# Altium project DEP_REVC.PrjPcb
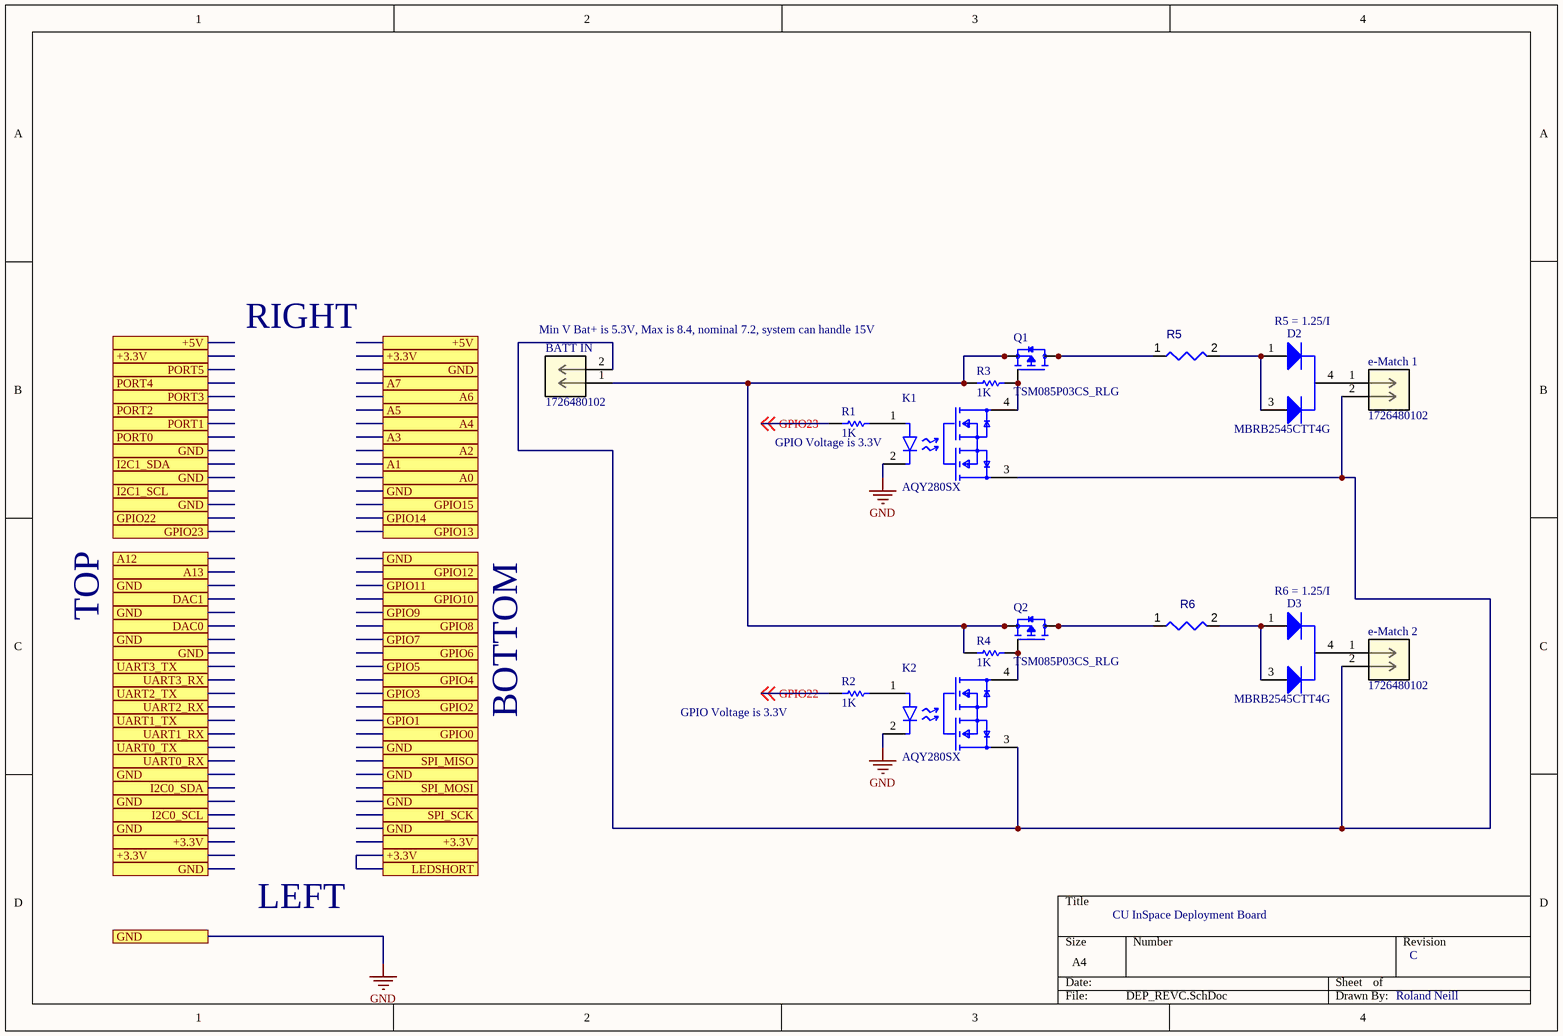
[diagram p0: DEP_REVC.SchDoc]
1 sheet, 15 parts. Net scope: flat (ports and power ports of the same name join across sheets).
Board file: DEP_REVC.PcbDoc

## Sheet DEP_REVC.SchDoc
size A4; SheetNumber: 1; SheetTotal: 1; SPICEModelCacheUQVOHRBJ: <root> / <DocumentId>UQVOHRBJ</DocumentId> / </root>

### Parts
BATT_IN  1726480102  [CON_1726480102]
D2  MBRB2545CTT4G  [ONSC-D2PAK-3-418B-04_V]
D3  MBRB2545CTT4G  [ONSC-D2PAK-3-418B-04_V]
e-Match_1  1726480102  [CON_1726480102]
e-Match_2  1726480102  [CON_1726480102]
K1  AQY280SX  [FP-AQY282SZ-IPC_A]
K2  AQY280SX  [FP-AQY282SZ-IPC_A]
Q1  TSM085P03CS_RLG  [SOP127P600X200-8N]
Q2  TSM085P03CS_RLG  [SOP127P600X200-8N]
R1  value 1K  [6-0805_N]  (hidden comment: Resistor)
R2  value 1K  [6-0805_N]  (hidden comment: Resistor)
R3  value 1K  [6-0805_N]  (hidden comment: Resistor)
R4  value 1K  [6-0805_N]  (hidden comment: Resistor)
R5  35221R5JT  [RESC6432X12N]  (value not drawn)
R6  35221R5JT  [RESC6432X12N]  (value not drawn)

### Ports
+3.3V (see DEP_REVC[1B], DEP_REVC[1D]), +5V (see DEP_REVC[1B]), A0, A1, A2, A3, A4, A5, A6, A7, A12, A13, DAC0, DAC1, GND (see DEP_REVC[1B], DEP_REVC[1C], DEP_REVC[1D]), GPIO0, GPIO1, GPIO2, GPIO3, GPIO4, GPIO5, GPIO6, GPIO7, GPIO8, GPIO9, GPIO10, GPIO11, GPIO12, GPIO13, GPIO14, GPIO15, GPIO22, GPIO23, I2C0_SCL, I2C0_SDA, I2C1_SCL, I2C1_SDA, LEDSHORT, PORT0, PORT1, PORT2, PORT3, PORT4, PORT5, SPI_MISO, SPI_MOSI, SPI_SCK, UART0_RX, UART0_TX, UART1_RX, UART1_TX, UART2_RX, UART2_TX, UART3_RX, UART3_TX

### Nets
GND: K1.2(DC-) K2.2(DC-) ; port GND
+3.3V: port +3.3V, port LEDSHORT
GPIO22: R2.1 ; off-sheet GPIO22
GPIO23: R1.1 ; off-sheet GPIO23
NetBATT_IN_1: BATT_IN.1 Q1.1(S) Q1.2(S) Q1.3(S) Q2.1(S) Q2.2(S) Q2.3(S) R3.1 R4.1
NetBATT_IN_2: BATT_IN.2 e-Match_1.2 e-Match_2.2 K1.3(1_AC/DC) K2.3(1_AC/DC)
NetD2_1: D2.1(A1) D2.3(A2) R5.2
NetD2_4: D2.4(K) e-Match_1.1
NetD3_1: D3.1(A1) D3.3(A2) R6.2
NetD3_4: D3.4(K) e-Match_2.1
NetK1_1: K1.1(DC+) R1.2
NetK1_4: K1.4(2_AC/DC) Q1.4(G) R3.2
NetK2_1: K2.1(DC+) R2.2
NetK2_4: K2.4(2_AC/DC) Q2.4(G) R4.2
NetQ1_5: Q1.5(D) Q1.6(D) Q1.7(D) Q1.8(D) R5.1
NetQ2_5: Q2.5(D) Q2.6(D) Q2.7(D) Q2.8(D) R6.1

### Notes on the sheet
- RIGHT
- (near BATT_IN) Min V Bat+ is 5.3V, Max is 8.4, nominal 7.2, system can handle 15V
- (near D2) R5 = 1.25/I
- GPIO Voltage is 3.3V
- TOP
- BOTTOM
- (near D3) R6 = 1.25/I
- (near R2) GPIO Voltage is 3.3V
- LEFT
- CU InSpace Deployment Board
- C
- Roland Neill

### Library data of the parts
BATT_IN e-Match_1 e-Match_2 = 1726480102: No Description Available; Mfr_Name: Molex Connector Corporation; Copyright: Copyright (C) 2022 Ultra Librarian. All rights reserved.; Manufacturer_Part_Number: 1726480102; RefDes: RefDes; Type: DEV
D2 D3 = CMP-004-00032-1: Rectifier Diode Schottky 45V 30A 3-Pin(2+Tab) D2PAK T/R; Case/Package: D2PAK
K1 K2 = CMP-00000-1: Relay Ssr 50MA 1.5V Dc-in 0.5A 60V Ac/dc-out 4-PIN Sop T/r; Output Current: 500mA; Isolation Voltage: 1.5kV; Input Type: DC; Throw Configuration: SPST; Forward Current: 1.8mA; On-State Resistance: 2.5R; RoHS Compliant: Yes; Max Operating Temperature: 85°C; Max Input Current: 50mA; Number of Pins: 4; Isolation Voltage-Max: 1.5kV; Lead Free: Lead Free; Case/Package: SOP; Max Input Voltage: 1.5V; Height: 2.7mm; Radiation Hardening: No; Output Voltage: 60V; Input Current: 50mA; Max Output Current: 500mA; Series: PhotoMOS™ AQY; Min Operating Temperature: -40°C; Package Quantity: 1000; Load Current: 500mA; Termination: Gull Wing; Mount: Surface Mount; Relay Type: Relay; Max Output Voltage: 60V; Length: 6.4mm; Width: 4.78mm; REACH SVHC: No SVHC; Packaging: Tape and Reel; On-state Resistance-Max: 2.5R
Q1 Q2 = TSM085P03CS_RLG: MF: {'manufacturer': u'Taiwan Semiconductor'}; Value: *; Price: None; Package: None; Availability: Unavailable; MP: TSM085P03CS_RLG
R1-R4 = Resistor: TC1: 0; SimulationGenericComponent: True; TC2: 0
R5 R6 = CMP-009-00177-2: Res Thick Film 2512 1.5 Ohm 5% 3W ±200ppm/°C Molded SMD T/R; Voltage Rating (DC): 250V; Resistance: 1.5; Power Rating: 3W; Voltage Rating: 250V; Mount: Surface Mount; Max Power Dissipation: 3W; Case Code (Metric): 6432; Resistance Tolerance: 5%